# EAGLE schematic bot_display (EAGLE 9.6.0)
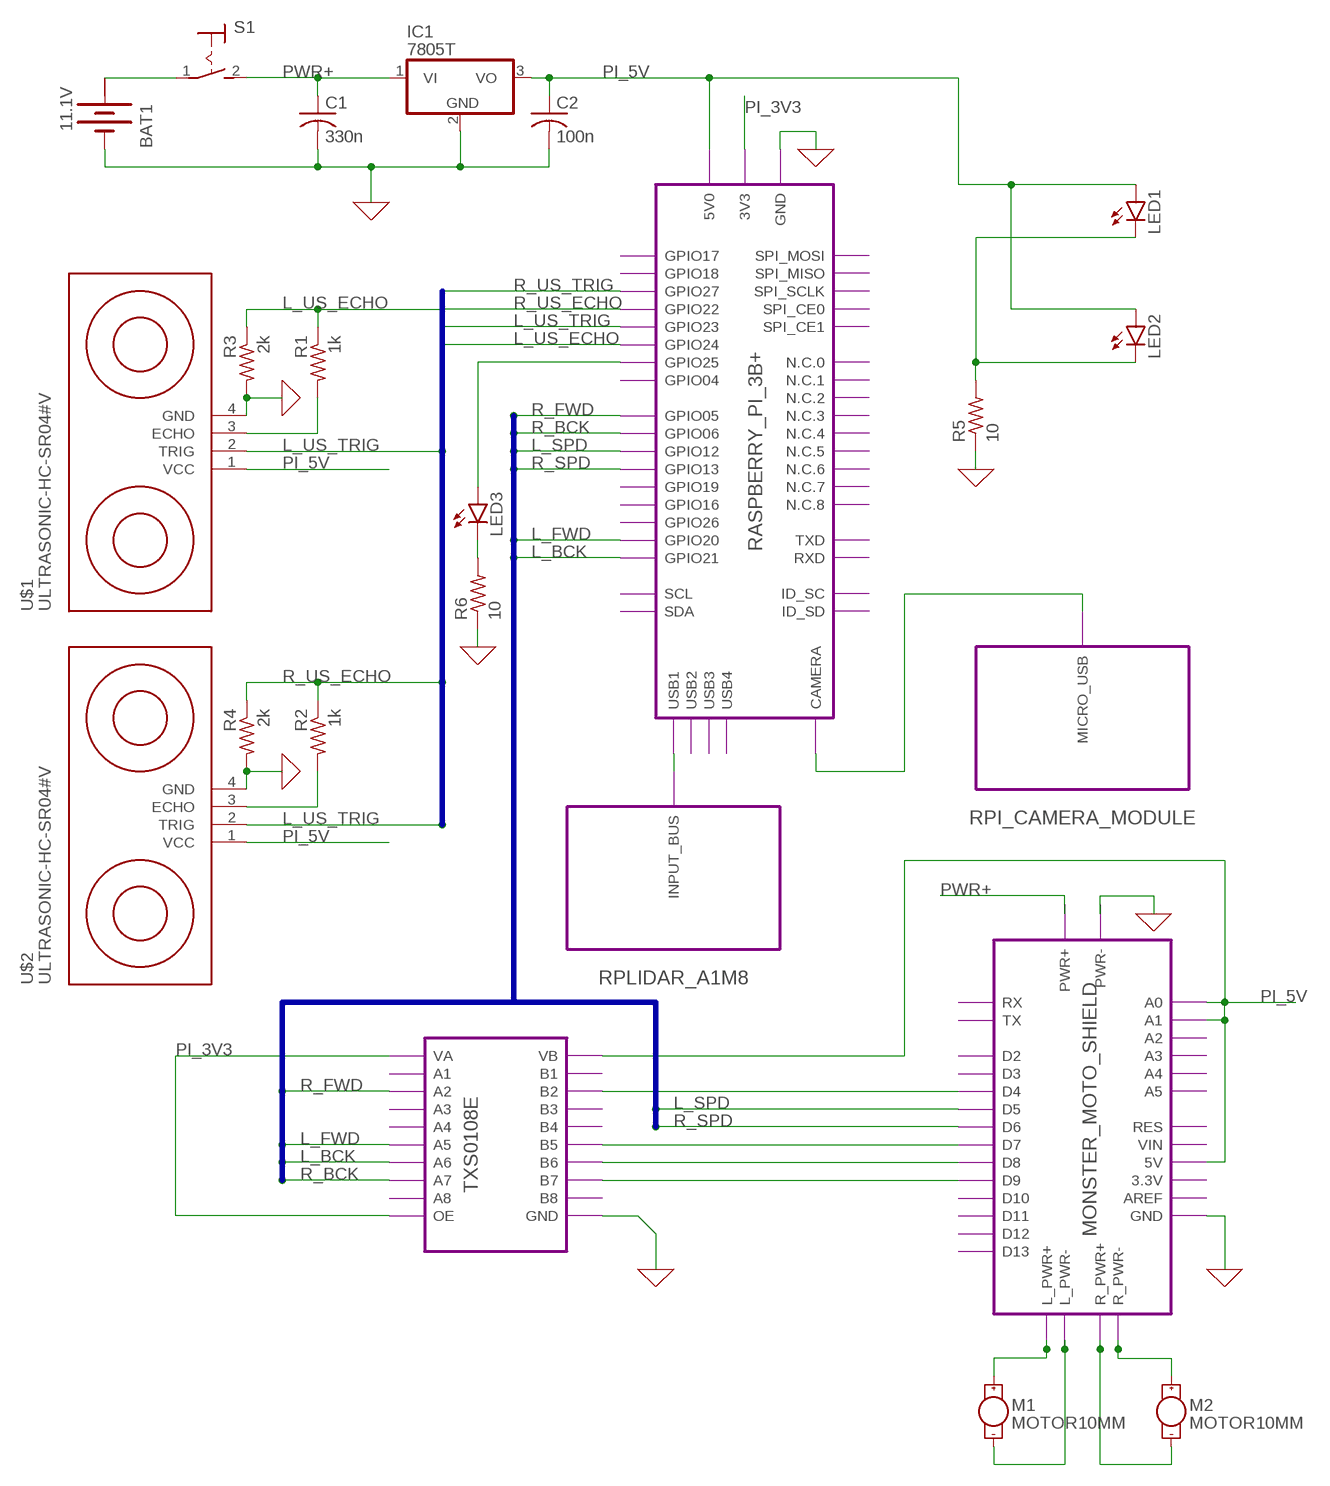
[diagram p0: schematic, sheet 1]

## Parts
BAT1  11.1V  BATTERY  [BATTERY]
C1  330n  C-US025-025X050  [C025-025X050]
C2  100n  C-US025-025X050  [C025-025X050]
IC1  7805T  [TO220H]
LED1  LED5MM  [LED5MM]
LED2  LED5MM  [LED5MM]
LED3  LED5MM  [LED5MM]
M1  MOTOR10MM  [VIBE-MOTOR-10MM]
M2  MOTOR10MM  [VIBE-MOTOR-10MM]
R1  1k  R-US_0207/10  [0207/10]
R2  1k  R-US_0207/10  [0207/10]
R3  2k  R-US_0207/10  [0207/10]
R4  2k  R-US_0207/10  [0207/10]
R5  10  R-US_0207/10  [0207/10]
R6  10  R-US_0207/10  [0207/10]
S1  MS243  [MS243]
U$1  ULTRASONIC-HC-SR04#V  [ULTRASONIC-HC-SR04#V]
U$2  ULTRASONIC-HC-SR04#V  [ULTRASONIC-HC-SR04#V]

## Module instances
TXS0108E = TXS0108E
MONSTER_MOTO_SHIELD = MONSTER_MOTO_SHIELD
RASPBERRY_PI_3B+ = RASPBERRY_PI_3B+
RPI_CAMERA_MODULE = RPI_CAMERA_MODULE
RPLIDAR_A1M8 = RPLIDAR_A1M8

## Nets
0: BAT1.- C1.2 C2.2 IC1.2(GND) R3.2 R4.2 R5.1 R6.1 U$1.4(GND) U$2.4(GND) ; port TXS0108E.GND MONSTER_MOTO_SHIELD.GND MONSTER_MOTO_SHIELD.PWR- RASPBERRY_PI_3B+.GND ; supply symbol labelled GND
L_BCK: port RASPBERRY_PI_3B+.GPIO21 TXS0108E.A6
L_FWD: port RASPBERRY_PI_3B+.GPIO20 TXS0108E.A5
L_SPD: port RASPBERRY_PI_3B+.GPIO12 MONSTER_MOTO_SHIELD.D5
L_US_ECHO: R1.1 R3.1 ; port RASPBERRY_PI_3B+.GPIO24
L_US_TRIG: U$1.2(TRIG) U$2.2(TRIG) ; port RASPBERRY_PI_3B+.GPIO23
N$1: R1.2 U$1.3(ECHO)
N$2: port RASPBERRY_PI_3B+.CAMERA RPI_CAMERA_MODULE.MICRO_USB
N$3: M1.+ ; port MONSTER_MOTO_SHIELD.L_PWR+
N$4: M1.- ; port MONSTER_MOTO_SHIELD.L_PWR-
N$5: LED1.K(C) LED2.K(C) R5.2
N$6: M2.+ ; port MONSTER_MOTO_SHIELD.R_PWR-
N$7: M2.- ; port MONSTER_MOTO_SHIELD.R_PWR+
N$8: port RASPBERRY_PI_3B+.USB1 RPLIDAR_A1M8.INPUT_BUS
N$9: R2.2 U$2.3(ECHO)
N$10: LED3.A ; port RASPBERRY_PI_3B+.GPIO25
N$11: LED3.K(C) R6.2
N$12: BAT1.+ S1.1(P)
N$13: port TXS0108E.B2 MONSTER_MOTO_SHIELD.D4
N$14: port TXS0108E.B5 MONSTER_MOTO_SHIELD.D7
N$15: port TXS0108E.B6 MONSTER_MOTO_SHIELD.D8
N$16: port TXS0108E.B7 MONSTER_MOTO_SHIELD.D9
PI_3V3: port TXS0108E.OE TXS0108E.VA RASPBERRY_PI_3B+.3V3
PI_5V: C2.1 IC1.3(VO) LED1.A LED2.A U$1.1(VCC) U$2.1(VCC) ; port MONSTER_MOTO_SHIELD.A0 MONSTER_MOTO_SHIELD.5V MONSTER_MOTO_SHIELD.A1 TXS0108E.VB RASPBERRY_PI_3B+.5V0
PWR+: C1.1 IC1.1(VI) S1.2(S) ; port MONSTER_MOTO_SHIELD.PWR+
R_BCK: port RASPBERRY_PI_3B+.GPIO06 TXS0108E.A7
R_FWD: port RASPBERRY_PI_3B+.GPIO05 TXS0108E.A2
R_SPD: port RASPBERRY_PI_3B+.GPIO13 MONSTER_MOTO_SHIELD.D6
R_US_ECHO: R2.1 R4.1 ; port RASPBERRY_PI_3B+.GPIO22
R_US_TRIG: port RASPBERRY_PI_3B+.GPIO27

## Buses
L_BCK,L_FWD,L_SPD,R_BCK,R_FWD,R_SPD
L_US_ECHO,L_US_TRIG,R_US_ECHO,R_US_TRIG

## Power pins joined to a net without a drawn wire
+: BAT1.+@1(+)

## Library data of the parts
BAT1 = special:BATTERY: BATTERY
C1 C2 = rcl:C-US: CAPACITOR, American symbol; SPICEPREFIX: C
IC1 = linear:78*: Positive VOLTAGE REGULATOR Source: http://cache.national.com/ds/LM/LM78L05.pdf http://www.fairchildsemi.com/ds/LM/LM7805.pdf
LED1-LED3 = led:LED: LED OSRAM: - CHIPLED LG R971, LG N971, LY N971, LG Q971, LY Q971, LO R971, LY R971 LH N974, LH R974 LS Q976, LO Q976, LY Q976 LO Q996 - Hyper CHIPLED LW Q18S LB Q993, LB Q99A, LB R99A - SideLED LS A670, LO A670, LY A670, LG A670, LP A670 LB A673, LV A673, LT A673, LW A673 LH A674 LY A675 LS A676, LA A676, LO A676, LY A676, LW A676 LS A679, LY A679, LG A679 - Hyper Micro SIDELED® LS Y876, LA Y876, LO Y876, LY Y876 LT Y87S - SmartLED LW L88C, LW L88S LB L89C, LB L89S, LG L890 LS L89K, LO L89K, LY L89K LS L896, LA L896, LO L896, LY L896 - TOPLED LS T670, LO T670, LY T670, LG T670, LP T670 LSG T670, LSP T670, LSY T670, LOP T670, LYG T670 LG T671, LOG T671, LSG T671 LB T673, LV T673, LT T673, LW T673 LH T674 LS T676, LA T676, LO T676, LY T676, LB T676, LH T676, LSB T676, LW T676 LB T67C, LV T67C, LT T67C, LS T67K, LO T67K, LY T67K, LW E67C LS E67B, LA E67B, LO E67B, LY E67B, LB E67C, LV E67C, LT E67C LW T67C LS T679, LY T679, LG T679 LS T770, LO T770, LY T770, LG T770, LP T770 LB T773, LV T773, LT T773, LW T773 LH T774 LS E675, LA E675, LY E675, LS T675 LS T776, LA T776, LO T776, LY T776, LB T776 LHGB T686 LT T68C, LB T68C - Hyper Mini TOPLED® LB M676 - Mini TOPLED Santana® LG M470 LS M47K, LO M47K, LY M47K Source: http://www.osram.convergy.de LUXEON: - LUMILED® LXK2-PW12-R00, LXK2-PW12-S00, LXK2-PW14-U00, LXK2-PW14-V00 LXK2-PM12-R00, LXK2-PM12-S00, LXK2-PM14-U00 LXK2-PE12-Q00, LXK2-PE12-R00, LXK2-PE12-S00, LXK2-PE14-T00, LXK2-PE14-U00 LXK2-PB12-K00, LXK2-PB12-L00, LXK2-PB12-M00, LXK2-PB14-N00, LXK2-PB14-P00, LXK2-PB14-Q00 LXK2-PR12-L00, LXK2-PR12-M00, LXK2-PR14-Q00, LXK2-PR14-R00 LXK2-PD12-Q00, LXK2-PD12-R00, LXK2-PD12-S00 LXK2-PH12-R00, LXK2-PH12-S00 LXK2-PL12-P00, LXK2-PL12-Q00, LXK2-PL12-R00 Source: www.luxeon.com KINGBRIGHT: KA-3528ASYC Source: www.kingbright.com
M1 M2 = SparkFun-Electromechanical:MOTOR: Motor (Single-Phase) Two-terminal, single-phase motors. SparkFun Products Vibration Motor <https://www.sparkfun.com/products/8449> (ROB-08449) Physical dimension and wire connections for this powerful vibration motor. Motor has a self adhesive backing.; PROD_ID: COMP-08572; SF_SKU: ROB-08449
R1-R6 = resistor:R-US_: RESISTOR, American symbol
S1 = switch:MS243: TOGGLE SWITCH
U$1 U$2 = diy-modules:ULTRASONIC-HC-SR04: Ultrasonic Ranging Module HC-SR04 More details available here: http://randomnerdtutorials.com/complete-guide-for-ultrasonic-sensor-hc-sr04/ Click here to find device on ebay.com <http://www.ebay.com/sch/hc+sr04+ultrasonic>

## Module TXS0108E
Ports: VA(pwr) A1(io) A2(io) A3(io) A4(io) A5(io) A6(io) A7(io) A8(io) OE(in) VB(pwr) B2(io) B1(io) B3(io) B4(io) B5(io) B6(io) B7(io) B8(io) GND(pwr)
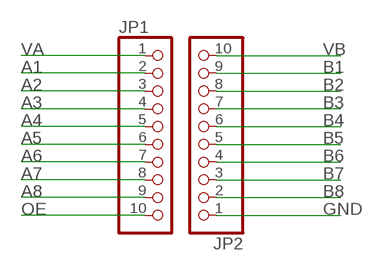
[diagram p1: schematic, module TXS0108E, sheet 1]

### Parts
JP1  PINHD-1X10  [1X10]
JP2  PINHD-1X10  [1X10]

### Nets
A1: JP1.2
A2: JP1.3
A3: JP1.4
A4: JP1.5
A5: JP1.6
A6: JP1.7
A7: JP1.8
A8: JP1.9
B1: JP2.9
B2: JP2.8
B3: JP2.7
B4: JP2.6
B5: JP2.5
B6: JP2.4
B7: JP2.3
B8: JP2.2
GND: JP2.1
OE: JP1.10
VA: JP1.1
VB: JP2.10

### Library data of the parts
JP1 JP2 = pinhead:PINHD-1X10: PIN HEADER

## Module MONSTER_MOTO_SHIELD
Ports: RX(io) TX(io) D2(io) D3(io) D4(io) D5(io) D6(io) D7(io) D8(io) D9(io) D10(io) D11(io) D12(io) D13(io) A0(io) A1(io) A2(io) A3(io) A4(io) A5(io) RES(io) VIN(io) 5V(io) 3.3V(io) AREF(io) GND(io) PWR+(io) PWR-(io) L_PWR+(io) L_PWR-(io) R_PWR+(io) R_PWR-(io)

### Library data of the parts

## Module RASPBERRY_PI_3B+
Ports: GPIO17(io) GPIO18(io) GPIO27(io) GPIO22(io) GPIO23(io) GPIO24(io) GPIO25(io) GPIO04(io) GPIO05(io) GPIO06(io) GPIO12(io) GPIO13(io) GPIO19(io) GPIO16(io) GPIO26(io) GPIO20(io) GPIO21(io) SCL(io) SDA(io) SPI_MOSI(io) SPI_MISO(io) SPI_SCLK(io) SPI_CE0(io) SPI_CE1(io) N.C.0(io) N.C.1(io) N.C.2(io) N.C.3(io) N.C.4(io) N.C.5(io) N.C.6(io) N.C.7(io) N.C.8(io) TXD(io) RXD(io) ID_SC(io) ID_SD(io) 5V0(io) 3V3(io) GND(io) USB1(io) USB2(io) USB3(io) USB4(io) CAMERA(io)

### Library data of the parts

## Module RPI_CAMERA_MODULE
Ports: MICRO_USB(io)

### Library data of the parts

## Module RPLIDAR_A1M8
Ports: INPUT_BUS(io)

### Library data of the parts